# EasyEDA schematic PCB_PI.json
TITLE: Sheet_1; REV: 1.0; Date: 2023-06-25; Sheet: 1/1; Drawn By: johannes_bittner; Company: Your Company
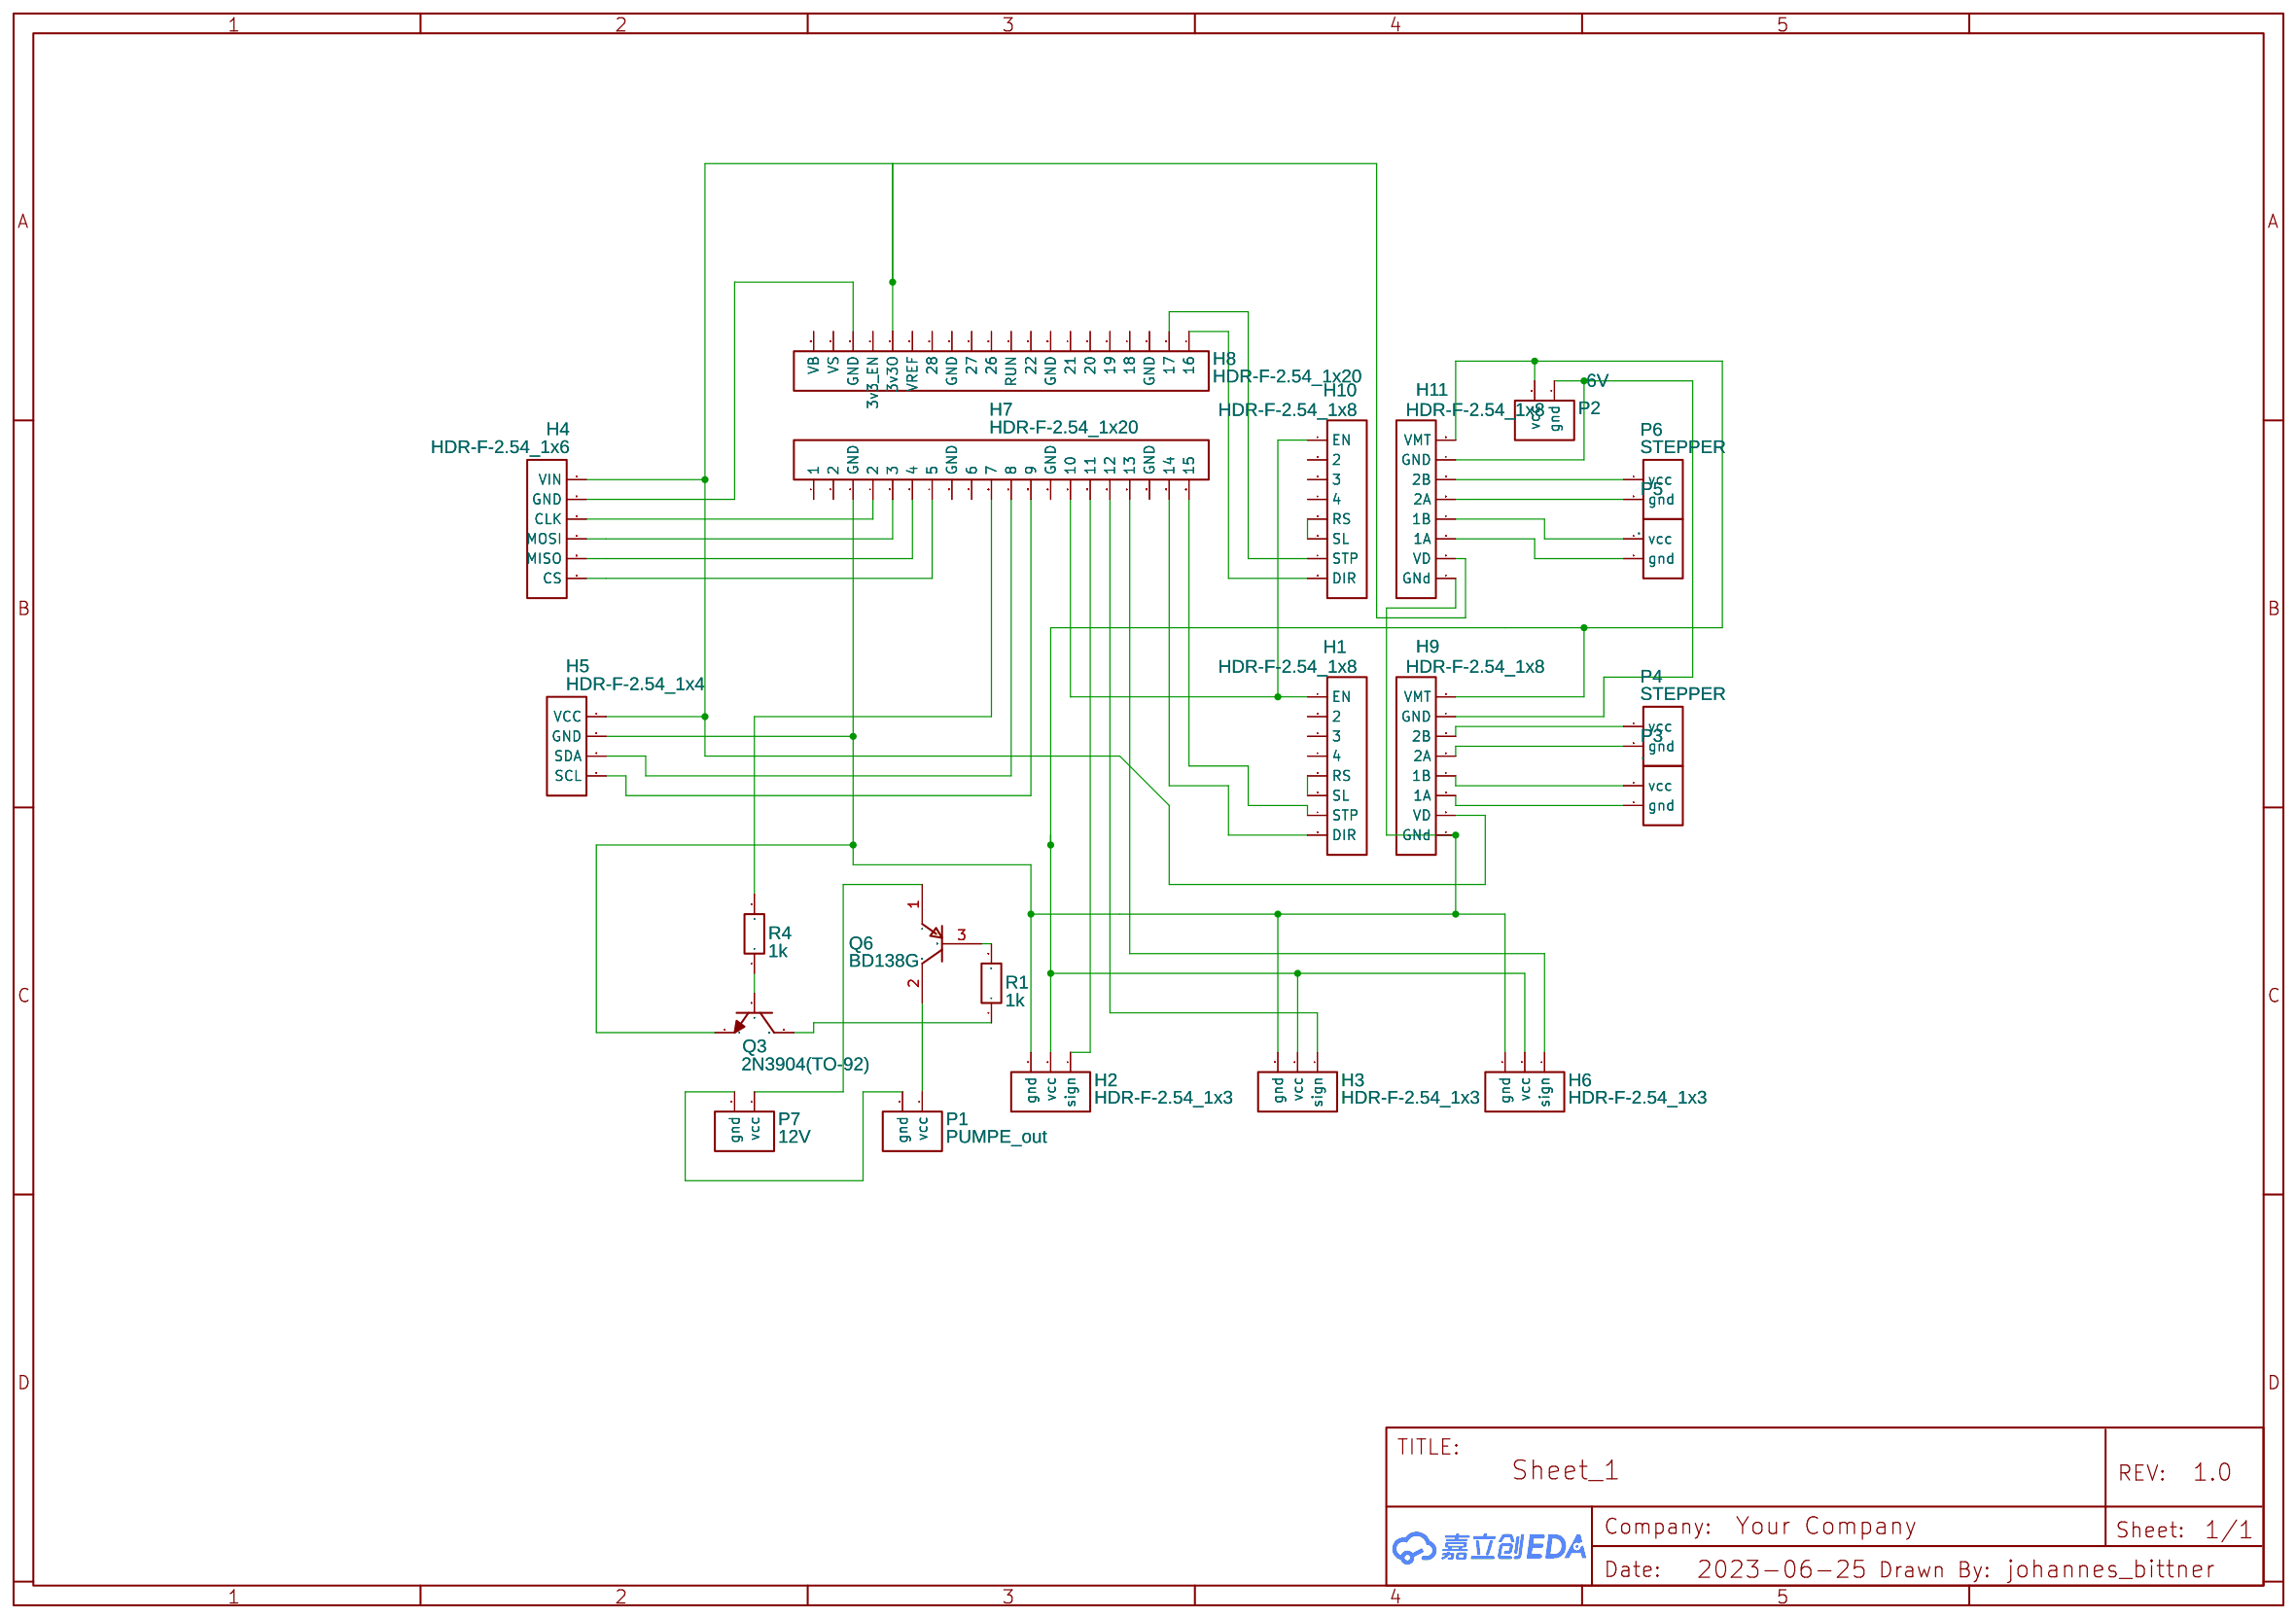
[diagram p0: schematic sheet]

## Parts
H1  HDR-F-2.54_1x8  [HDR-F-2.54_1X8]
H2  HDR-F-2.54_1x3  [HDR-F-2.54_1X3]
H3  HDR-F-2.54_1x3  [HDR-F-2.54_1X3]
H4  HDR-F-2.54_1x6  [HDR-F-2.54_1X6]
H5  HDR-F-2.54_1x4  [HDR-F-2.54_1X4]
H6  HDR-F-2.54_1x3  [HDR-F-2.54_1X3]
H7  HDR-F-2.54_1x20  [HDR-F-2.54_1X20]
H8  HDR-F-2.54_1x20  [HDR-F-2.54_1X20]
H9  HDR-F-2.54_1x8  [HDR-F-2.54_1X8]
H10  HDR-F-2.54_1x8  [HDR-F-2.54_1X8]
H11  HDR-F-2.54_1x8  [HDR-F-2.54_1X8]
P1  PUMPE_out  [CONN-TH_2P-P5.00]
P2  6V  [CONN-TH_2P-P5.00]
P3  .  [CONN-TH_2P-P5.00]
P4  STEPPER  [CONN-TH_2P-P5.00]
P5  .  [CONN-TH_2P-P5.00]
P6  STEPPER  [CONN-TH_2P-P5.00]
P7  12V  [CONN-TH_2P-P5.00]
Q3  2N3904(TO-92)  [TO-92-3_L5.1-W4.1-P1.27-L]
Q6  BD138G  [ONSC-TO-225-3-77-09]
R1  1k  [R_AXIAL-0.5]
R4  1k  [R_AXIAL-0.5]

## Library data of the parts
H1 H9-H11 = HDR-F-2.54_1x8: Supplier Part: C225505; Supplier: LCSC; Contributor: LCEDA_Lib
H2 H3 H6 = HDR-F-2.54_1x3: Supplier Part: C146690; Supplier: LCSC; Contributor: LCEDA_Lib
H4 = HDR-F-2.54_1x6: Supplier Part: C40877; Supplier: LCSC; Contributor: LCEDA_Lib
H5 = HDR-F-2.54_1x4: Supplier Part: C225501; Supplier: LCSC; Contributor: LCEDA_Lib
H7 H8 = HDR-F-2.54_1x20: Supplier Part: C50984; Supplier: LCSC; Contributor: LCEDA_Lib
P1-P7 = CONN-TH_2P-P5.00: Supplier: LCSC; Contributor: LCEDA_Lib
Q3 = 2N3904(TO-92): Supplier: LCSC; Manufacturer: SEMTECH; Manufacturer Part: 2N3904; Supplier Part: C118538; Contributor: LCEDA_Lib
Q6 = BD138G: Plastic Medium-Power Silicon PNP Transistor, 3-Pin TO-225, Pb-Free, Bulk Box
R1 R4 = R_AXIAL-0.5_EU: Contributor: LCEDA_Lib

## Nets
Net-(H1-1): H1.1(EN) H7.14(10) H10.1(EN)
Net-(H1-5): H1.5(RS) H1.6(SL)
Net-(H1-7): H1.7(STP) H7.20(15)
Net-(H1-8): H1.8(DIR) H7.19(14)
Net-(H2-1): H2.1(sign) H7.15(11)
Net-(H2-2): H2.2(vcc) H3.2(vcc) H6.2(vcc) H9.8(VMT) H11.8(VMT) P2.2(vcc)
Net-(H2-3): H2.3(gnd) H3.3(gnd) H5.3(GND) H6.3(gnd) H7.3(GND) H9.1(GNd) H11.1(GNd) Q3.1(E)
Net-(H3-1): H3.1(sign) H7.16(12)
Net-(H4-1): H4.1(VIN) H5.4(VCC) H8.16(3v3O) H9.2(VD) H11.2(VD)
Net-(H4-2): H4.2(GND) H8.18(GND)
Net-(H4-3): H4.3(CLK) H7.4(2)
Net-(H4-4): H4.4(MOSI) H7.5(3)
Net-(H4-5): H4.5(MISO) H7.6(4)
Net-(H4-6): H4.6(CS) H7.7(5)
Net-(H5-1): H5.1(SCL) H7.12(9)
Net-(H5-2): H5.2(SDA) H7.11(8)
Net-(H6-1): H6.1(sign) H7.17(13)
Net-(H7-10): H7.10(7) R4.2
Net-(H8-1): H8.1(16) H10.8(DIR)
Net-(H8-2): H8.2(17) H10.7(STP)
Net-(H9-3): H9.3(1A) P3.2(gnd)
Net-(H9-4): H9.4(1B) P3.1(vcc)
Net-(H9-5): H9.5(2A) P4.2(gnd)
Net-(H9-6): H9.6(2B) P4.1(vcc)
Net-(H9-7): H9.7(GND) H11.7(GND) P2.1(gnd)
Net-(H10-5): H10.5(RS) H10.6(SL)
Net-(H11-3): H11.3(1A) P5.2(gnd)
Net-(H11-4): H11.4(1B) P5.1(vcc)
Net-(H11-5): H11.5(2A) P6.2(gnd)
Net-(H11-6): H11.6(2B) P6.1(vcc)
Net-(P1-1): P1.1(vcc) Q6.2(C)
Net-(P1-2): P1.2(gnd) P7.2(gnd)
Net-(P7-1): P7.1(vcc) Q6.1(E)
Net-(Q3-2): Q3.2(B) R4.1
Net-(Q3-3): Q3.3(C) R1.1
Net-(Q6-3): Q6.3(B) R1.2

Not connected (* = marked no-connect by the designer): H1 2 3 4; H7 1 2 8(GND) 9(6) 13(GND) 18(GND); H8 3(GND) 4(18) 5(19) 6(20) 7(21) 8(GND) 9(22) 10(RUN) 11(26) 12(27) 13(GND) 14(28) 15(VREF) 17(3v3_EN) 19(VS) 20(VB); H10 2 3 4
